# EasyEDA schematic ADS1248 Eval Board.json
TITLE: ADS1248 Evaluation Board; REV: 2.0; Date: 2019-11-04; Sheet: 1/1; Drawn By: Adin Ackerman; Company: None
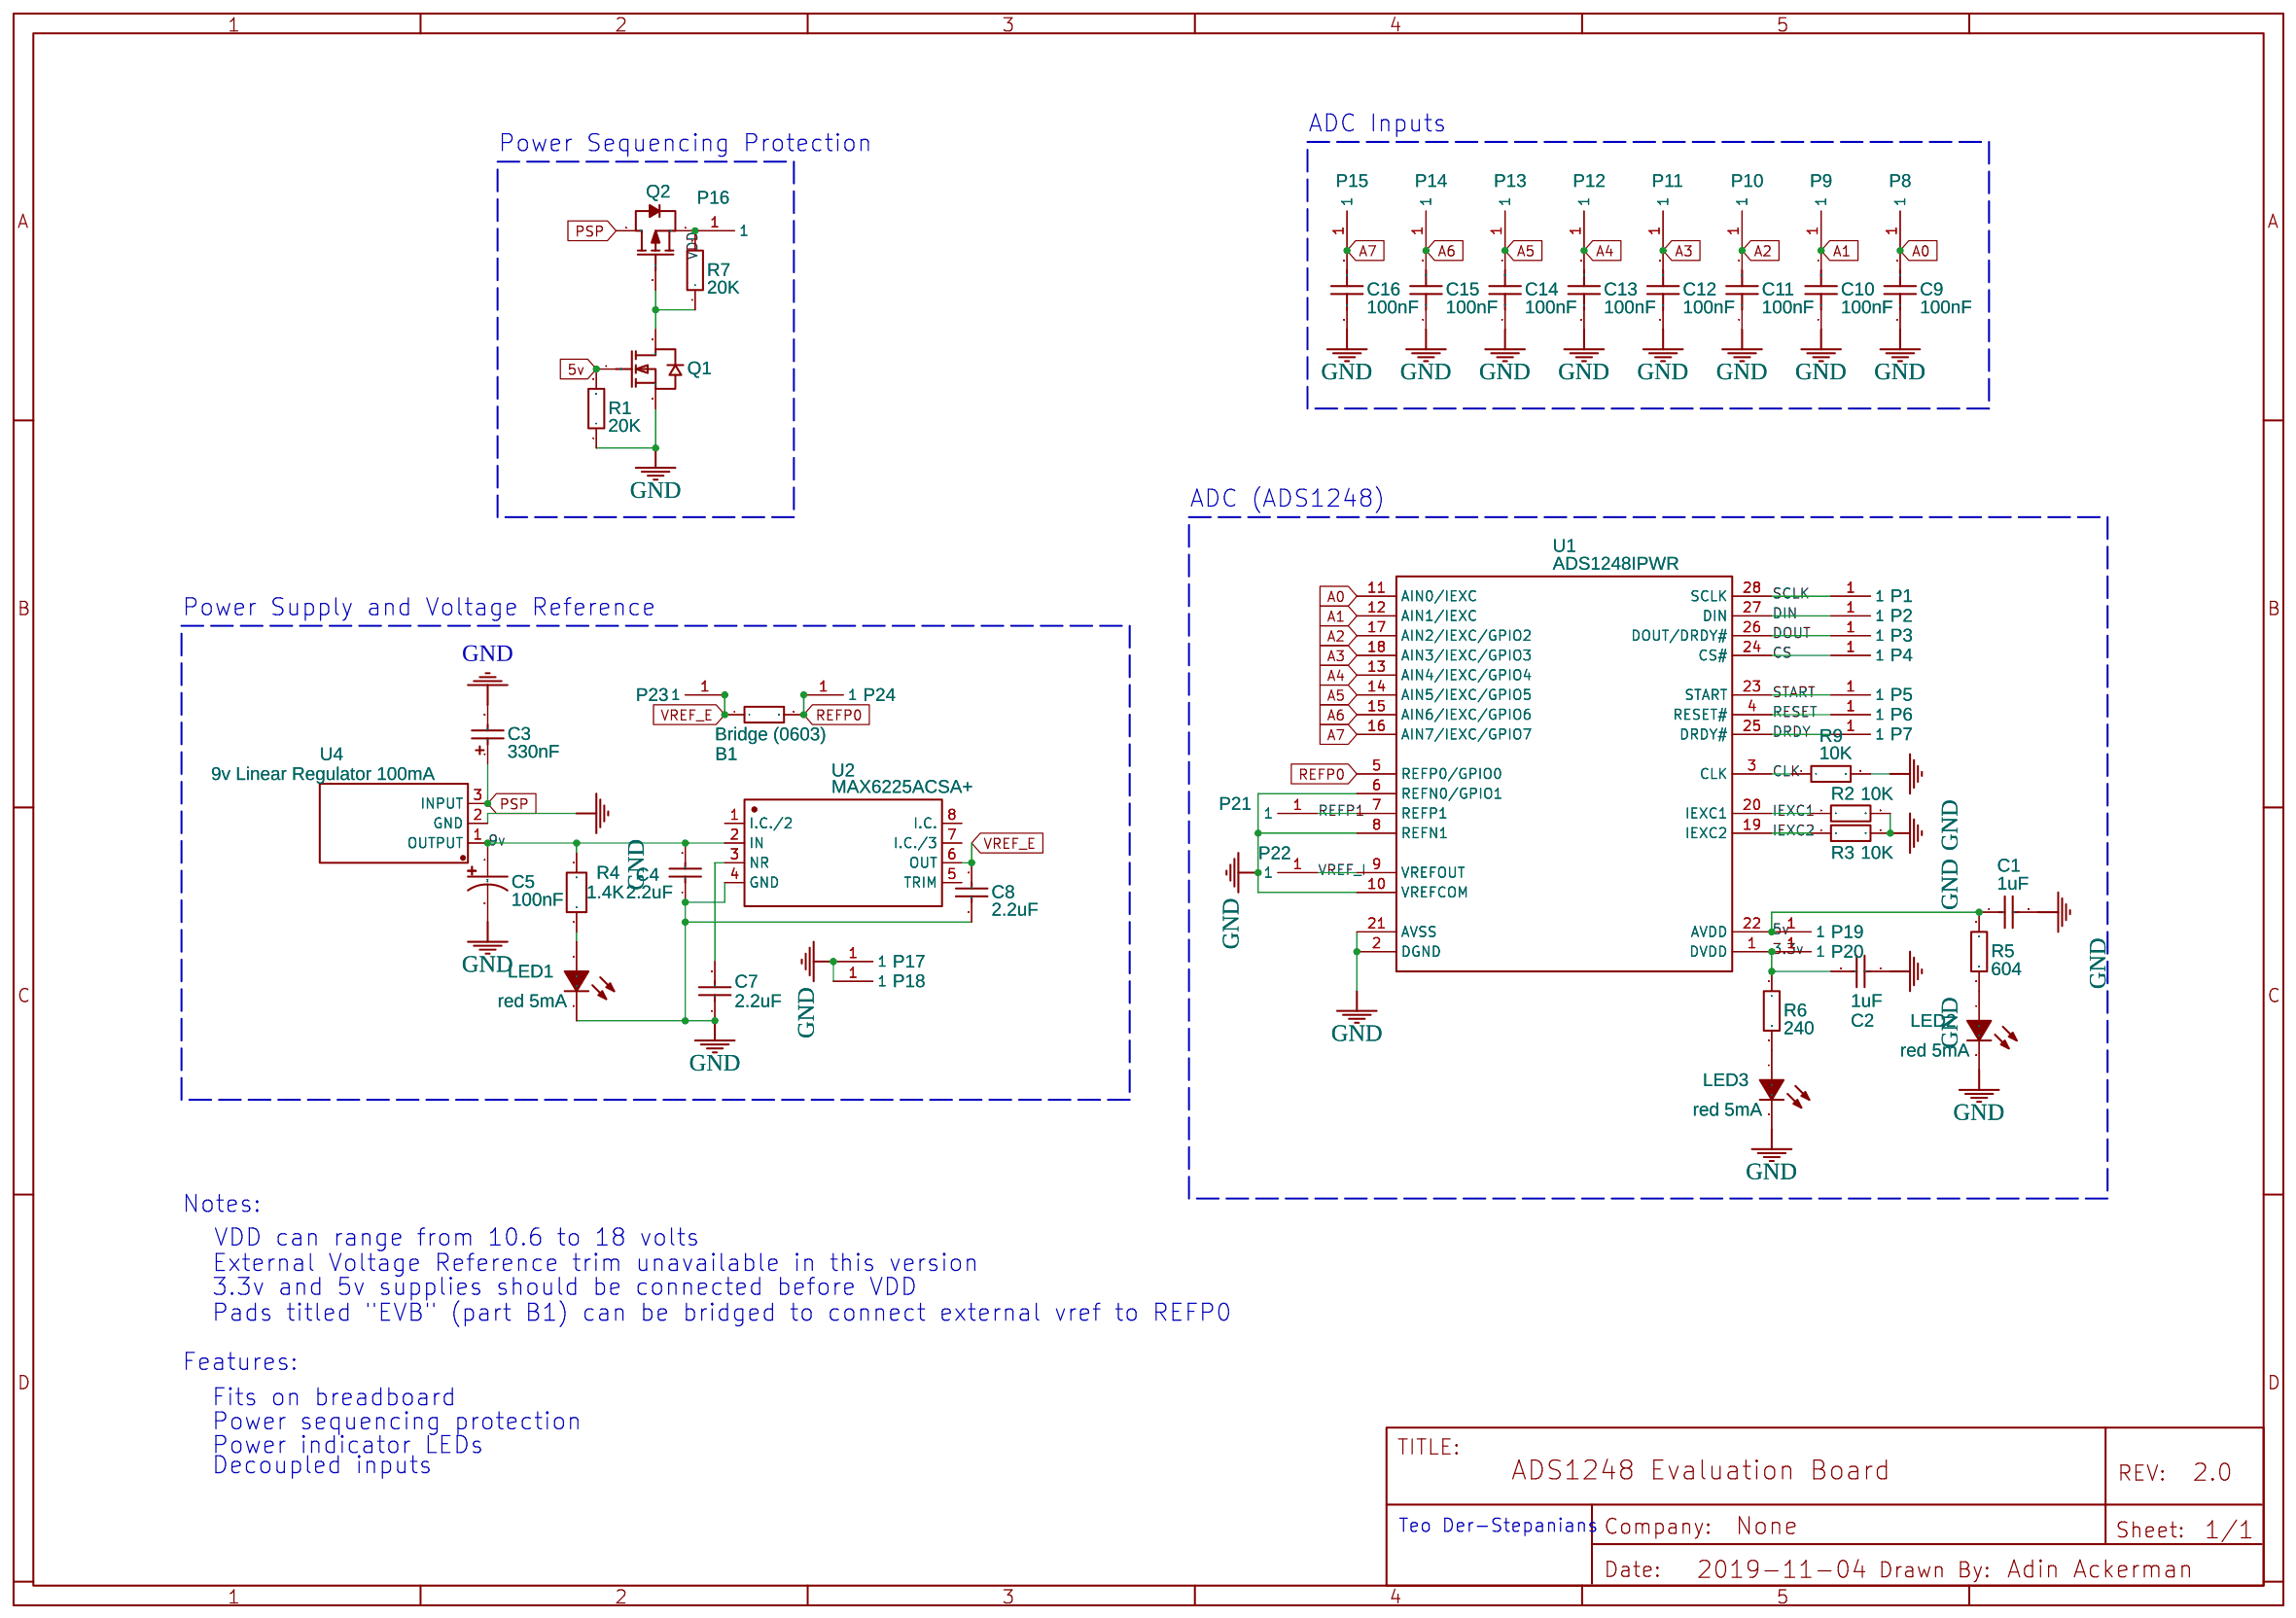
[diagram p0: schematic sheet]

## Parts
B1  Bridge (0603)  [0603]
C1  1uF  [0805]
C2  1uF  [0805]
C3  330nF  [CAP-SMD_L3.2-W1.6]
C4  2.2uF  [0805]
C5  100nF  [CAP-SMD_L2.0-W1.2]
C7  2.2uF  [0805]
C8  2.2uF  [0805]
C9  100nF  [0603]
C10  100nF  [0603]
C11  100nF  [0603]
C12  100nF  [0603]
C13  100nF  [0603]
C14  100nF  [0603]
C15  100nF  [0603]
C16  100nF  [0603]
LED1  red 5mA  [LED-0603]
LED2  red 5mA  [LED-0603]
LED3  red 5mA  [LED-0603]
P1  Standard 100 mil pad  [STANDARD 100 MIL PAD]
P2  Standard 100 mil pad  [STANDARD 100 MIL PAD]
P3  Standard 100 mil pad  [STANDARD 100 MIL PAD]
P4  Standard 100 mil pad  [STANDARD 100 MIL PAD]
P5  Standard 100 mil pad  [STANDARD 100 MIL PAD]
P6  Standard 100 mil pad  [STANDARD 100 MIL PAD]
P7  Standard 100 mil pad  [STANDARD 100 MIL PAD]
P8  Standard 100 mil pad  [STANDARD 100 MIL PAD]
P9  Standard 100 mil pad  [STANDARD 100 MIL PAD]
P10  Standard 100 mil pad  [STANDARD 100 MIL PAD]
P11  Standard 100 mil pad  [STANDARD 100 MIL PAD]
P12  Standard 100 mil pad  [STANDARD 100 MIL PAD]
P13  Standard 100 mil pad  [STANDARD 100 MIL PAD]
P14  Standard 100 mil pad  [STANDARD 100 MIL PAD]
P15  Standard 100 mil pad  [STANDARD 100 MIL PAD]
P16  Standard 100 mil pad  [STANDARD 100 MIL PAD]
P17  Standard 100 mil pad  [STANDARD 100 MIL PAD]
P18  Standard 100 mil pad  [STANDARD 100 MIL PAD]
P19  Standard 100 mil pad  [STANDARD 100 MIL PAD]
P20  Standard 100 mil pad  [STANDARD 100 MIL PAD]
P21  Standard 100 mil pad  [STANDARD 100 MIL PAD]
P22  Standard 100 mil pad  [STANDARD 100 MIL PAD]
P23  Standard 100 mil pad  [STANDARD 100 MIL PAD]
P24  Standard 100 mil pad  [STANDARD 100 MIL PAD]
Q1  AO3402_C14385  [SOT-23_L2.9-W1.3-P0.95-LS2.4-BR]
Q2  AO3407A  [SOT-23-3_L2.9-W1.6-P1.90-LS2.8-BR]
R1  20K  [0603]
R2  10K  [0603]
R3  10K  [0603]
R4  1.4K  [R0603]
R5  604  [0603]
R6  240  [0805]
R7  20K  [0603]
R9  10K  [0603]
U1  ADS1248IPWR  [TSSOP-28_28PIN-L9.80-W6.60-PITCH0.65-BL]
U2  MAX6225ACSA+  [SOIC-8]
U4  9v Linear Regulator 100mA  [SOT-89-3_L4.5-W2.5-P1.50-LS4.2-BR]

## Library data of the parts
B1 = -: Contributor: Adin Ackerman
C1 C2 = CL21B105KOFNNNE: Supplier: LCSC; Manufacturer: SAMSUNG; Supplier Part: C24123
C3 = F921V334MAA: Supplier: LCSC; Supplier Part: C382101; Manufacturer: AVX; Contributor: LCSC
C4 C7 C8 = CL21A225KAFNNNE: Supplier: LCSC; Manufacturer: SAMSUNG; Supplier Part: C87994
C5 = TMCP1D104MTRF: Supplier: LCSC; Supplier Part: C154088; Manufacturer: Vishay Intertech; Contributor: LCSC
C9-C16 = CL10B104KB8NNNC: Supplier: LCSC; Manufacturer: SAMSUNG; Supplier Part: C1591
LED1-LED3 = -: Supplier: LCSC; Supplier Part: C131266; Manufacturer: Everlight Elec; Manufacturer Part: 19-217/R6C-AL1M2VY/3T(GDB); Contributor: LCSC
P1-P24 = -: Contributor: adinackerman
Q1 = -: Supplier: LCSC; Manufacturer: AOS; Manufacturer Part: AO3402; image: //image.lceda.cn/szlcsc/C14385.jpg; Supplier Part: C14385; LCSC Assembly: Yes; SMT Type: Extend
Q2 = -: Supplier: LCSC; Manufacturer: AOS; image: //image.lceda.cn/szlcsc/C15155.jpg; Supplier Part: C15155; LCSC Assembly: Yes; SMT Type: Extend
R1 R7 = RC0603FR-0720KL: Supplier: LCSC; Manufacturer: YAGEO; Supplier Part: C105575
R2 R3 R9 = RC0603FR-0710KL: Supplier: LCSC; Manufacturer: YAGEO; Supplier Part: C98220
R4 = ERJ3EKF1401V: Supplier: LCSC; Supplier Part: C402982; Manufacturer: PANASONIC; Contributor: LCSC
R5 = AC0603FR-07604RL: Supplier: LCSC; Supplier Part: C227993; Manufacturer: YAGEO; Contributor: LCSC
R6 = 0805W8F2400T5E: Supplier: LCSC; Manufacturer: UniOhm; LCSC Assembly: Yes; Supplier Part: C17572; SMT Type: Basic
U1 = -: Supplier: LCSC; Manufacturer: TI; image: //image.lceda.cn/szlcsc/C30576.jpg; Supplier Part: C30576; LCSC Assembly: Yes; SMT Type: Extend
U4 = -: Supplier: LCSC; Supplier Part: C108741; Manufacturer: Diodes Incorporated; Manufacturer Part: AZ78L09RTR-E1; Contributor: LCSC; LCSC Assembly: Yes; SMT Type: Extend

## Nets
3.3v: C2.1 P20.1 R6.1 U1.1(DVDD)
5v: C1.1 P19.1 Q1.1(G) R1.2 R5.2 U1.22(AVDD)
9v: C4.2 C5.1 R4.2 U2.2(IN) U4.1(OUTPUT)
GND: C1.2 C2.2 C3.2 C4.1 C5.2 C7.1 C8.1 C9.1 C10.1 C11.1 C12.1 C13.1 C14.1 C15.1 C16.1 LED1.2(C) LED2.2(C) LED3.2(C) P17.1 P18.1 Q1.2(S) R1.1 R2.2 R3.2 R9.2 U1.2(DGND) U1.6(REFN0/GPIO1) U1.8(REFN1) U1.10(VREFCOM) U1.21(AVSS) U2.4(GND) U4.2(GND)
VDD: P16.1 Q2.2(S) R7.2
A0: C9.2 P8.1 U1.11(AIN0/IEXC)
A1: C10.2 P9.1 U1.12(AIN1/IEXC)
A2: C11.2 P10.1 U1.17(AIN2/IEXC/GPIO2)
A3: C12.2 P11.1 U1.18(AIN3/IEXC/GPIO3)
A4: C13.2 P12.1 U1.13(AIN4/IEXC/GPIO4)
A5: C14.2 P13.1 U1.14(AIN5/IEXC/GPIO5)
A6: C15.2 P14.1 U1.15(AIN6/IEXC/GPIO6)
A7: C16.2 P15.1 U1.16(AIN7/IEXC/GPIO7)
CLK: R9.1 U1.3(CLK)
CS: P4.1 U1.24(CS#)
DIN: P2.1 U1.27(DIN)
DOUT: P3.1 U1.26(DOUT/DRDY#)
DRDY: P7.1 U1.25(DRDY#)
IEXC1: R2.1 U1.20(IEXC1)
IEXC2: R3.1 U1.19(IEXC2)
PSP: C3.1 Q2.3(D) U4.3(INPUT)
REFP0: B1.2 P24.1 U1.5(REFP0/GPIO0)
REFP1: P21.1 U1.7(REFP1)
RESET: P6.1 U1.4(RESET#)
SCLK: P1.1 U1.28(SCLK)
START: P5.1 U1.23(START)
VREF_E: B1.1 C8.2 P23.1 U2.6(OUT)
VREF_I: P22.1 U1.9(VREFOUT)
Net-(C7-2): C7.2 U2.3(NR)
Net-(LED1-1): LED1.1(A) R4.1
Net-(LED2-1): LED2.1(A) R5.1
Net-(LED3-1): LED3.1(A) R6.2
Net-(Q1-3): Q1.3(D) Q2.1(G) R7.1

Not connected (* = marked no-connect by the designer): U2 1(I.C./2) 5(TRIM) 7(I.C./3) 8(I.C.)

## Notes on the sheet
- ADC Inputs
- Power Sequencing Protection
- ADC (ADS1248)
- Power Supply and Voltage Reference
- Notes:
- VDD can range from 10.6 to 18 volts
- External Voltage Reference trim unavailable in this version
- 3.3v and 5v supplies should be connected before VDD
- Pads titled "EVB" (part B1) can be bridged to connect external vref to REFP0
- Features:
- Fits on breadboard
- Power sequencing protection
- Power indicator LEDs
- Decoupled inputs
- Teo Der-Stepanians
